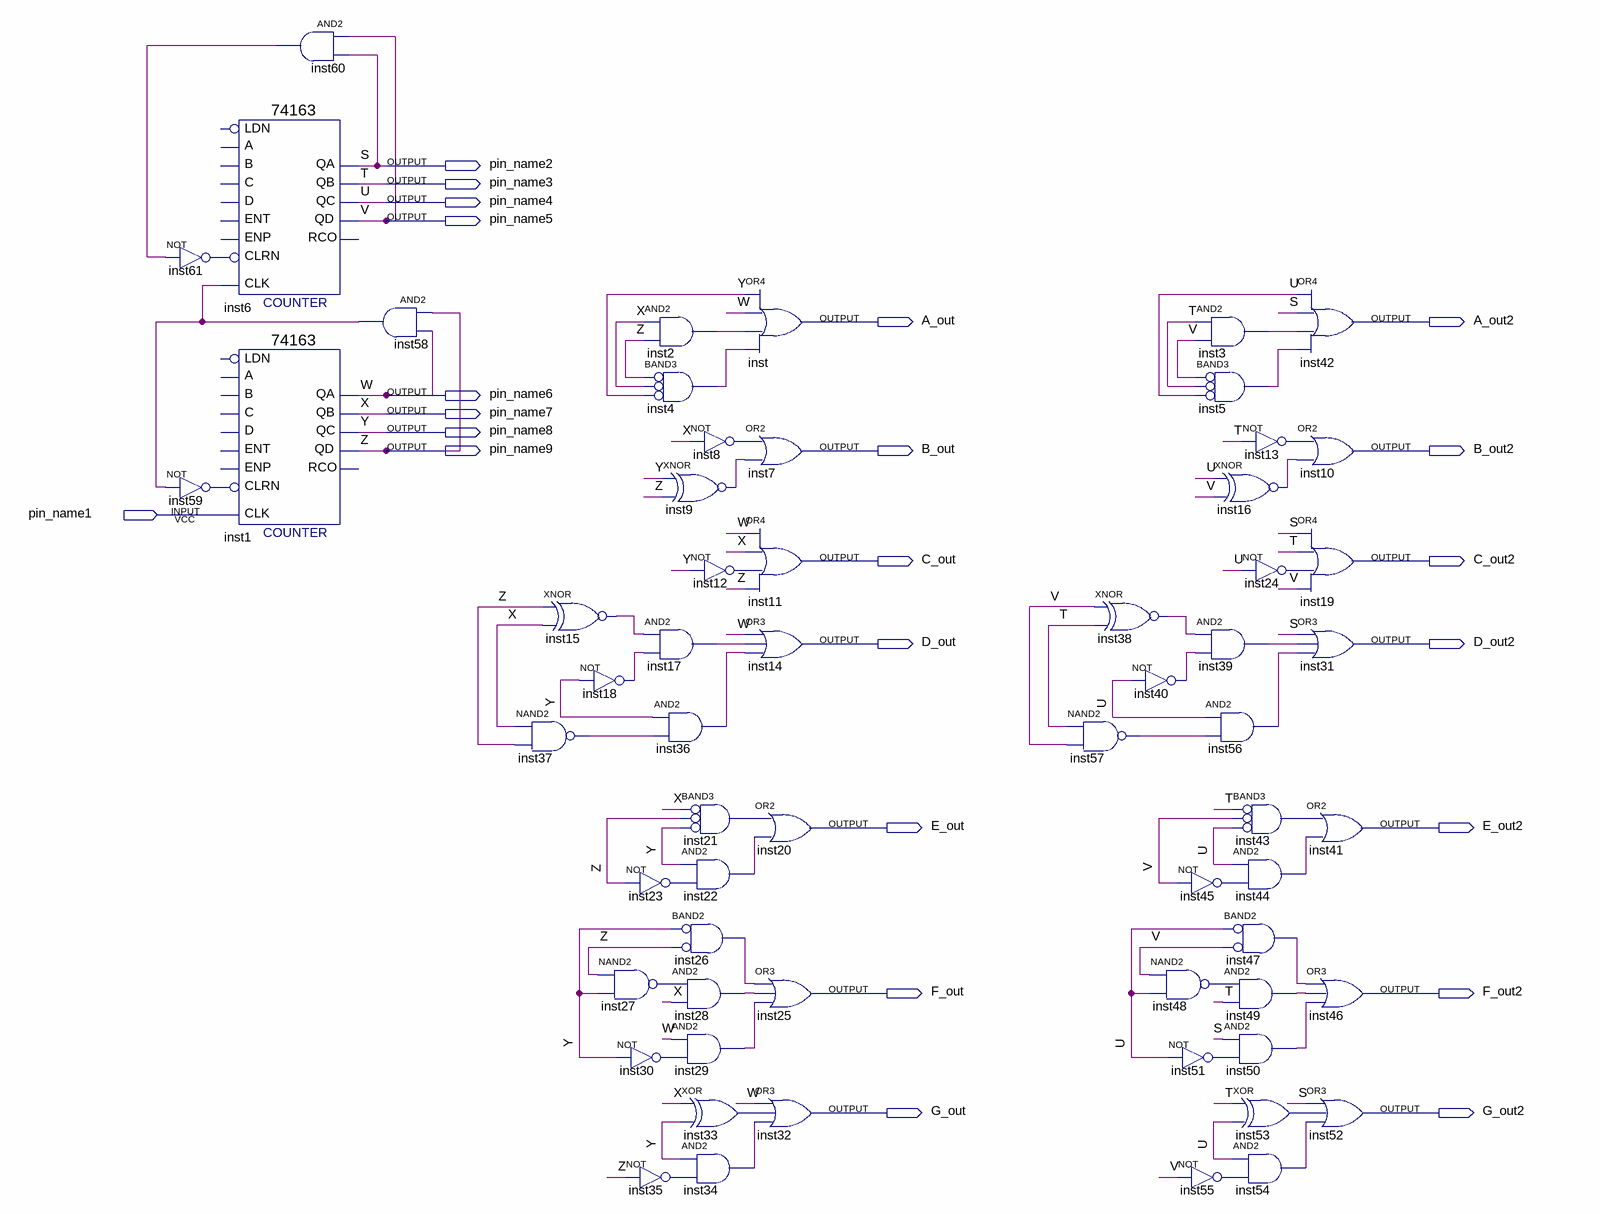
[diagram p0: schematic sheet]
// Quartus schematic SevenSegmentDisplay.bdf as structural Verilog: 62 symbols, 23 pins
module SevenSegmentDisplay (
  input  pin_name1,
  output pin_name2,
  output pin_name3,
  output pin_name4,
  output pin_name5,
  output A_out,
  output A_out2,
  output pin_name6,
  output pin_name7,
  output pin_name8,
  output pin_name9,
  output B_out,
  output B_out2,
  output C_out,
  output C_out2,
  output D_out,
  output D_out2,
  output E_out,
  output E_out2,
  output F_out,
  output F_out2,
  output G_out,
  output G_out2
);

  wire inst2_out, inst3_out, inst4_out, inst5_out, inst8_out, inst9_out, inst12_out, inst13_out, inst15_out,
       inst16_out, inst17_out, inst18_out, inst21_out, inst22_out, inst23_out, inst24_out, inst26_out,
       inst27_out, inst28_out, inst29_out, inst30_out, inst33_out, inst34_out, inst35_out, inst36_out,
       inst37_out, inst38_out, inst39_out, inst40_out, inst43_out, inst44_out, inst45_out, inst47_out,
       inst48_out, inst49_out, inst50_out, inst51_out, inst53_out, inst54_out, inst55_out, inst56_out,
       inst57_out, inst58_out, inst59_out, inst60_out, inst61_out;

  \74163  inst6 (
    .CLRN(inst61_out), .CLK(inst58_out), .QA(pin_name2), .QB(pin_name3), .QC(pin_name4), .QD(pin_name5));  // open: C, B, A, ENT, D, ENP, LDN, RCO
  not inst61 (inst61_out, inst60_out);
  \74163  inst1 (
    .CLRN(inst59_out), .CLK(pin_name1), .QA(pin_name6), .QB(pin_name7), .QC(pin_name8), .QD(pin_name9));  // open: C, B, A, ENT, D, ENP, LDN, RCO
  not inst59 (inst59_out, inst58_out);
  and inst60 (inst60_out, pin_name5, pin_name2);
  and inst58 (inst58_out, pin_name9, pin_name6);
  nand inst37 (inst37_out, pin_name7, pin_name9);
  xnor inst15 (inst15_out, pin_name9, pin_name7);
  not inst18 (inst18_out, pin_name8);
  nand inst27 (inst27_out, pin_name9, pin_name8);
  and inst2 (inst2_out, pin_name7, pin_name9);
  and inst4 (inst4_out, ~pin_name9, ~pin_name7, ~pin_name8);  // BAND3
  xnor inst9 (inst9_out, pin_name8, pin_name9);
  and inst17 (inst17_out, inst15_out, inst18_out);
  and inst36 (inst36_out, pin_name8, inst37_out);
  not inst23 (inst23_out, pin_name9);
  and inst26 (inst26_out, ~pin_name8, ~pin_name9);  // BAND2
  and inst28 (inst28_out, inst27_out, pin_name7);
  and inst29 (inst29_out, pin_name6, inst30_out);
  not inst30 (inst30_out, pin_name8);
  not inst35 (inst35_out, pin_name9);
  or inst (A_out, pin_name8, pin_name6, inst2_out, inst4_out);
  or inst7 (B_out, inst8_out, inst9_out);
  not inst8 (inst8_out, pin_name7);
  or inst11 (C_out, pin_name6, pin_name7, inst12_out, pin_name9);
  not inst12 (inst12_out, pin_name8);
  or inst14 (D_out, pin_name6, inst17_out, inst36_out);
  and inst21 (inst21_out, ~pin_name7, ~pin_name9, ~pin_name8);  // BAND3
  and inst22 (inst22_out, pin_name8, inst23_out);
  xor inst33 (inst33_out, pin_name7, pin_name8);
  and inst34 (inst34_out, pin_name8, inst35_out);
  or inst20 (E_out, inst21_out, inst22_out);
  or inst25 (F_out, inst26_out, inst28_out, inst29_out);
  or inst32 (G_out, pin_name6, inst33_out, inst34_out);
  xnor inst38 (inst38_out, pin_name5, pin_name3);
  nand inst57 (inst57_out, pin_name3, pin_name5);
  not inst40 (inst40_out, pin_name4);
  not inst45 (inst45_out, pin_name5);
  nand inst48 (inst48_out, pin_name5, pin_name4);
  not inst51 (inst51_out, pin_name4);
  not inst55 (inst55_out, pin_name5);
  and inst3 (inst3_out, pin_name3, pin_name5);
  and inst5 (inst5_out, ~pin_name5, ~pin_name3, ~pin_name4);  // BAND3
  not inst13 (inst13_out, pin_name3);
  xnor inst16 (inst16_out, pin_name4, pin_name5);
  not inst24 (inst24_out, pin_name4);
  and inst39 (inst39_out, inst38_out, inst40_out);
  and inst56 (inst56_out, pin_name4, inst57_out);
  and inst43 (inst43_out, ~pin_name3, ~pin_name5, ~pin_name4);  // BAND3
  and inst44 (inst44_out, pin_name4, inst45_out);
  and inst47 (inst47_out, ~pin_name4, ~pin_name5);  // BAND2
  and inst49 (inst49_out, inst48_out, pin_name3);
  and inst50 (inst50_out, pin_name2, inst51_out);
  xor inst53 (inst53_out, pin_name3, pin_name4);
  and inst54 (inst54_out, pin_name4, inst55_out);
  or inst42 (A_out2, pin_name4, pin_name2, inst3_out, inst5_out);
  or inst10 (B_out2, inst13_out, inst16_out);
  or inst19 (C_out2, pin_name2, pin_name3, inst24_out, pin_name5);
  or inst31 (D_out2, pin_name2, inst39_out, inst56_out);
  or inst41 (E_out2, inst43_out, inst44_out);
  or inst46 (F_out2, inst47_out, inst49_out, inst50_out);
  or inst52 (G_out2, pin_name2, inst53_out, inst54_out);

  // Other names for the same wires on the sheet: S = pin_name2; T = pin_name3; U = pin_name4; V = pin_name5;
  //   W = pin_name6; X = pin_name7; Y = pin_name8; Z = pin_name9
endmodule
